# Altium schematic sheet [16] Camera Connector.SchDoc
size A3; DocumentNumber: 16; SheetNumber: 16; SheetTotal: 16
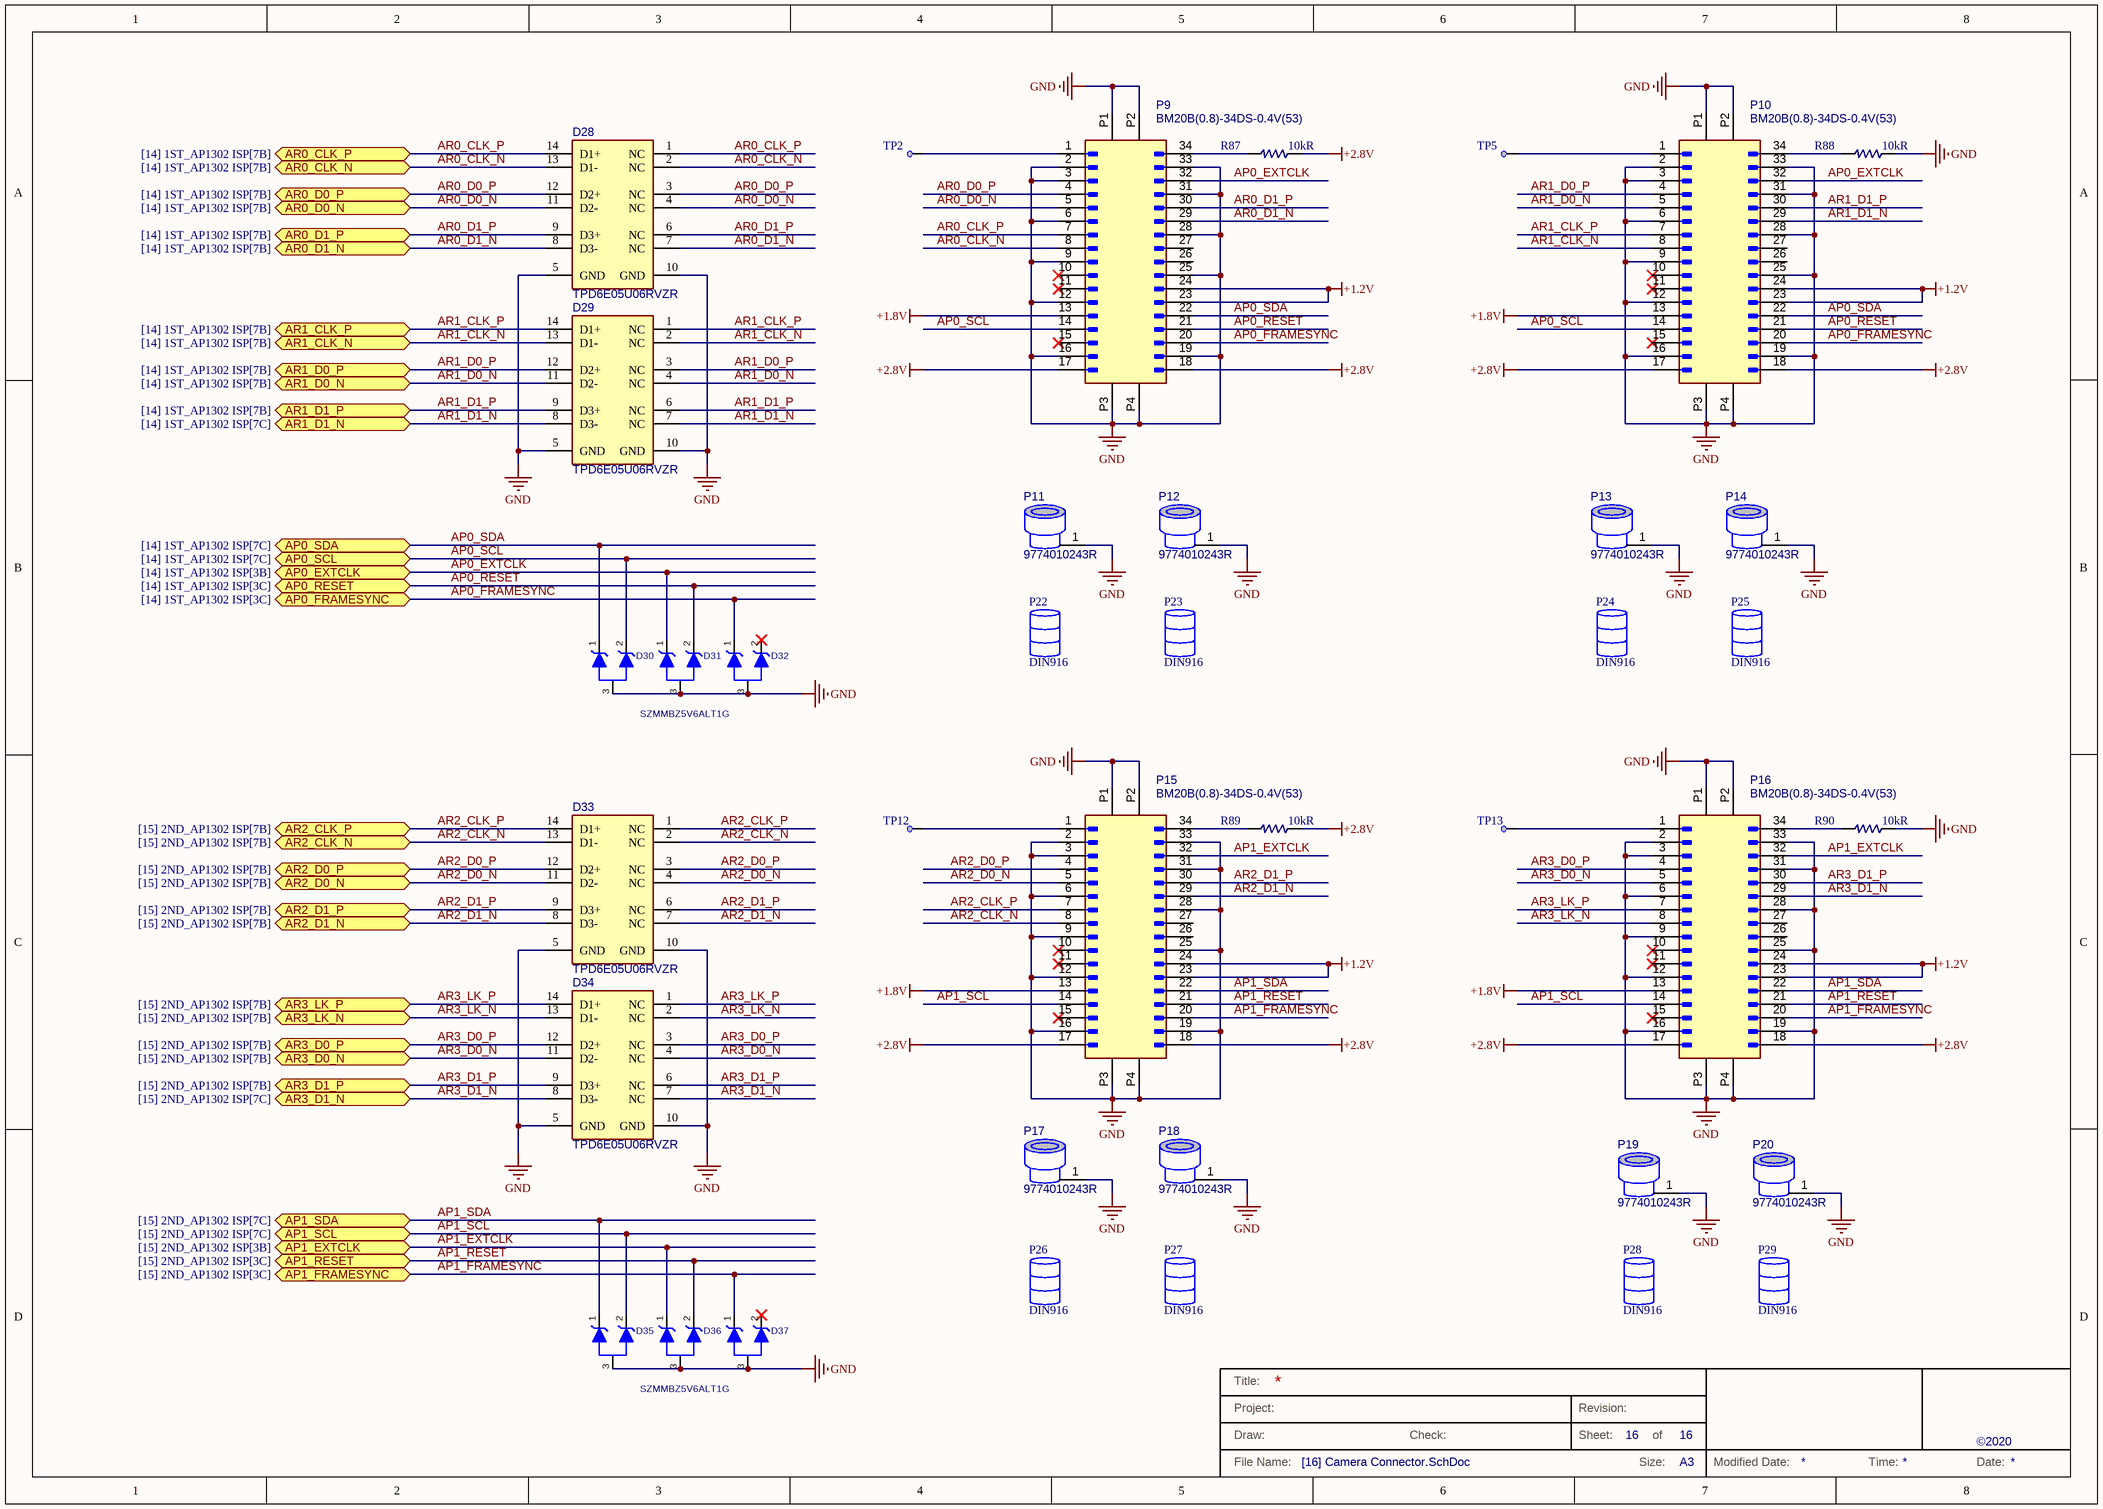
[diagram p0: [16] Camera Connector.SchDoc]

## Parts
D28  TPD6E05U06RVZR  [TPD6E05U06RVZR]
D29  TPD6E05U06RVZR  [TPD6E05U06RVZR]
D30  SZMMBZ5V6ALT1G  [ONSC-SOT-23-3-318-08_V]
D31  SZMMBZ5V6ALT1G  [ONSC-SOT-23-3-318-08_V]  (value not drawn)
D32  SZMMBZ5V6ALT1G  [ONSC-SOT-23-3-318-08_V]  (value not drawn)
D33  TPD6E05U06RVZR  [TPD6E05U06RVZR]
D34  TPD6E05U06RVZR  [TPD6E05U06RVZR]
D35  SZMMBZ5V6ALT1G  [ONSC-SOT-23-3-318-08_V]
D36  SZMMBZ5V6ALT1G  [ONSC-SOT-23-3-318-08_V]  (value not drawn)
D37  SZMMBZ5V6ALT1G  [ONSC-SOT-23-3-318-08_V]  (value not drawn)
P9  BM20B(0.8)-34DS-0.4V(53)  [BM20B(0.8)-34DS-0.4V(51)]
P10  BM20B(0.8)-34DS-0.4V(53)  [BM20B(0.8)-34DS-0.4V(51)]
P11  9774010243R  [WE_9774010243R]
P12  9774010243R  [WE_9774010243R]
P13  9774010243R  [WE_9774010243R]
P14  9774010243R  [WE_9774010243R]
P15  BM20B(0.8)-34DS-0.4V(53)  [BM20B(0.8)-34DS-0.4V(51)]
P16  BM20B(0.8)-34DS-0.4V(53)  [BM20B(0.8)-34DS-0.4V(51)]
P17  9774010243R  [WE_9774010243R]
P18  9774010243R  [WE_9774010243R]
P19  9774010243R  [WE_9774010243R]
P20  9774010243R  [WE_9774010243R]
P22  DIN916  [DIN916]
P23  DIN916  [DIN916]
P24  DIN916  [DIN916]
P25  DIN916  [DIN916]
P26  DIN916  [DIN916]
P27  DIN916  [DIN916]
P28  DIN916  [DIN916]
P29  DIN916  [DIN916]
R87  Resistance: 10kR  [R0402M]  (hidden comment: 10k)
R88  Resistance: 10kR  [R0402M]  (hidden comment: 10k)
R89  Resistance: 10kR  [R0402M]  (hidden comment: 10k)
R90  Resistance: 10kR  [R0402M]  (hidden comment: 10k)
TP2  TP  [Test point]  (value not drawn)  (net tie, no BOM)
TP5  TP  [Test point]  (value not drawn)  (net tie, no BOM)
TP12  TP  [Test point]  (value not drawn)  (net tie, no BOM)
TP13  TP  [Test point]  (value not drawn)  (net tie, no BOM)

## Ports
AP0_EXTCLK (bidir, see [14] 1ST_AP1302 ISP[3B]), AP0_FRAMESYNC (bidir, see [14] 1ST_AP1302 ISP[3C]), AP0_RESET (bidir, see [14] 1ST_AP1302 ISP[3C]), AP0_SCL (bidir, see [14] 1ST_AP1302 ISP[7C]), AP0_SDA (bidir, see [14] 1ST_AP1302 ISP[7C]), AP1_EXTCLK (bidir, see [15] 2ND_AP1302 ISP[3B]), AP1_FRAMESYNC (bidir, see [15] 2ND_AP1302 ISP[3C]), AP1_RESET (bidir, see [15] 2ND_AP1302 ISP[3C]), AP1_SCL (bidir, see [15] 2ND_AP1302 ISP[7C]), AP1_SDA (bidir, see [15] 2ND_AP1302 ISP[7C]), AR0_CLK_N (bidir, see [14] 1ST_AP1302 ISP[7B]), AR0_CLK_P (bidir, see [14] 1ST_AP1302 ISP[7B]), AR0_D0_N (bidir, see [14] 1ST_AP1302 ISP[7B]), AR0_D0_P (bidir, see [14] 1ST_AP1302 ISP[7B]), AR0_D1_N (bidir, see [14] 1ST_AP1302 ISP[7B]), AR0_D1_P (bidir, see [14] 1ST_AP1302 ISP[7B]), AR1_CLK_N (bidir, see [14] 1ST_AP1302 ISP[7B]), AR1_CLK_P (bidir, see [14] 1ST_AP1302 ISP[7B]), AR1_D0_N (bidir, see [14] 1ST_AP1302 ISP[7B]), AR1_D0_P (bidir, see [14] 1ST_AP1302 ISP[7B]), AR1_D1_N (bidir, see [14] 1ST_AP1302 ISP[7C]), AR1_D1_P (bidir, see [14] 1ST_AP1302 ISP[7B]), AR2_CLK_N (bidir, see [15] 2ND_AP1302 ISP[7B]), AR2_CLK_P (bidir, see [15] 2ND_AP1302 ISP[7B]), AR2_D0_N (bidir, see [15] 2ND_AP1302 ISP[7B]), AR2_D0_P (bidir, see [15] 2ND_AP1302 ISP[7B]), AR2_D1_N (bidir, see [15] 2ND_AP1302 ISP[7B]), AR2_D1_P (bidir, see [15] 2ND_AP1302 ISP[7B]), AR3_D0_N (bidir, see [15] 2ND_AP1302 ISP[7B]), AR3_D0_P (bidir, see [15] 2ND_AP1302 ISP[7B]), AR3_D1_N (bidir, see [15] 2ND_AP1302 ISP[7C]), AR3_D1_P (bidir, see [15] 2ND_AP1302 ISP[7B]), AR3_LK_N (bidir, see [15] 2ND_AP1302 ISP[7B]), AR3_LK_P (bidir, see [15] 2ND_AP1302 ISP[7B])

## Nets
+1.2V: P9.23 P9.24 P10.23 P10.24 P15.23 P15.24 P16.23 P16.24
+1.8V: P9.13 P10.13 P15.13 P16.13
+2.8V: P9.17 P9.18 P10.17 P10.18 P15.17 P15.18 P16.17 P16.18 R87.2 R89.2
GND: D28.5(GND) D28.10(GND) D29.5(GND) D29.10(GND) D30.3(A) D31.3(A) D32.3(A) D33.5(GND) D33.10(GND) D34.5(GND) D34.10(GND) D35.3(A) D36.3(A) D37.3(A) P9.2 P9.3 P9.6 P9.9 P9.12 P9.16 P9.19 P9.25 P9.28 P9.31 P9.33 P9.P1 P9.P2 P9.P3 P9.P4 P10.2 P10.3 P10.6 P10.9 P10.12 P10.16 P10.19 P10.25 P10.28 P10.31 P10.33 P10.P1 P10.P2 P10.P3 P10.P4 P11.1 P12.1 P13.1 P14.1 P15.2 P15.3 P15.6 P15.9 P15.12 P15.16 P15.19 P15.25 P15.28 P15.31 P15.33 P15.P1 P15.P2 P15.P3 P15.P4 P16.2 P16.3 P16.6 P16.9 P16.12 P16.16 P16.19 P16.25 P16.28 P16.31 P16.33 P16.P1 P16.P2 P16.P3 P16.P4 P17.1 P18.1 P19.1 P20.1 R88.2 R90.2
AP0_EXTCLK: D31.1(K1) P9.32 P10.32 ; port AP0_EXTCLK
AP0_FRAMESYNC: D32.1(K1) P9.20 P10.20 ; port AP0_FRAMESYNC
AP0_RESET: D31.2(K2) P9.21 P10.21 ; port AP0_RESET
AP0_SCL: D30.2(K2) P9.14 P10.14 ; port AP0_SCL
AP0_SDA: D30.1(K1) P9.22 P10.22 ; port AP0_SDA
AP1_EXTCLK: D36.1(K1) P15.32 P16.32 ; port AP1_EXTCLK
AP1_FRAMESYNC: D37.1(K1) P15.20 P16.20 ; port AP1_FRAMESYNC
AP1_RESET: D36.2(K2) P15.21 P16.21 ; port AP1_RESET
AP1_SCL: D35.2(K2) P15.14 P16.14 ; port AP1_SCL
AP1_SDA: D35.1(K1) P15.22 P16.22 ; port AP1_SDA
AR0_CLK_N: D28.2(NC) D28.13(D1-) P9.8 ; port AR0_CLK_N
AR0_CLK_P: D28.1(NC) D28.14(D1+) P9.7 ; port AR0_CLK_P
AR0_D0_N: D28.4(NC) D28.11(D2-) P9.5 ; port AR0_D0_N
AR0_D0_P: D28.3(NC) D28.12(D2+) P9.4 ; port AR0_D0_P
AR0_D1_N: D28.7(NC) D28.8(D3-) P9.29 ; port AR0_D1_N
AR0_D1_P: D28.6(NC) D28.9(D3+) P9.30 ; port AR0_D1_P
AR1_CLK_N: D29.2(NC) D29.13(D1-) P10.8 ; port AR1_CLK_N
AR1_CLK_P: D29.1(NC) D29.14(D1+) P10.7 ; port AR1_CLK_P
AR1_D0_N: D29.4(NC) D29.11(D2-) P10.5 ; port AR1_D0_N
AR1_D0_P: D29.3(NC) D29.12(D2+) P10.4 ; port AR1_D0_P
AR1_D1_N: D29.7(NC) D29.8(D3-) P10.29 ; port AR1_D1_N
AR1_D1_P: D29.6(NC) D29.9(D3+) P10.30 ; port AR1_D1_P
AR2_CLK_N: D33.2(NC) D33.13(D1-) P15.8 ; port AR2_CLK_N
AR2_CLK_P: D33.1(NC) D33.14(D1+) P15.7 ; port AR2_CLK_P
AR2_D0_N: D33.4(NC) D33.11(D2-) P15.5 ; port AR2_D0_N
AR2_D0_P: D33.3(NC) D33.12(D2+) P15.4 ; port AR2_D0_P
AR2_D1_N: D33.7(NC) D33.8(D3-) P15.29 ; port AR2_D1_N
AR2_D1_P: D33.6(NC) D33.9(D3+) P15.30 ; port AR2_D1_P
AR3_D0_N: D34.4(NC) D34.11(D2-) P16.5 ; port AR3_D0_N
AR3_D0_P: D34.3(NC) D34.12(D2+) P16.4 ; port AR3_D0_P
AR3_D1_N: D34.7(NC) D34.8(D3-) P16.29 ; port AR3_D1_N
AR3_D1_P: D34.6(NC) D34.9(D3+) P16.30 ; port AR3_D1_P
AR3_LK_N: D34.2(NC) D34.13(D1-) P16.8 ; port AR3_LK_N
AR3_LK_P: D34.1(NC) D34.14(D1+) P16.7 ; port AR3_LK_P
NetP9_1: P9.1 TP2.1(TP)
NetP9_34: P9.34 R87.1
NetP10_1: P10.1 TP5.1(TP)
NetP10_34: P10.34 R88.1
NetP15_1: P15.1 TP12.1(TP)
NetP15_34: P15.34 R89.1
NetP16_1: P16.1 TP13.1(TP)
NetP16_34: P16.34 R90.1

Not connected (* = marked no-connect by the designer): D32 2(K2)*; D37 2(K2)*; P9 10* 11* 15* 26 27; P10 10* 11* 15* 26 27; P15 10* 11* 15* 26 27; P16 10* 11* 15* 26 27

## Notes on the sheet
- Title:
- Project:
- Draw:
- Check:
- Revision:
- Sheet:
- of
- ©2020
- File Name:
- Size:
- A3
- Modified Date:
- Time:
- Date:

## Library data of the parts
D28 D29 D33 D34 = TPD6E05U06RVZR_symbol: ESD Suppressor Diode Array ±15kV@Air Gap/±12kV@Contact Disc 14-Pin UQFN T/R; Manufacturer 1: Texas Instruments; Direction: Unidirectional; Number of Bidirectional Channels: 6; Reverse Standoff Voltage: 5.5V; Min Breakdown Voltage: 6V; Clamping Voltage: 14V; Peak Pulse Power: 40W; Power Line Protection: Yes; Polarity: Bidirectional; Leakage Current: 10nA; Peak Pulse Current: 2.5A; Interface: LVDS,USB,Ethernet,HDMI,PCIe,SATA; Supplier 1: Digi-Key; Manufacturer Part Number 1: TPD6E05U06RVZR; Stock 1: 0; Pricing 1: 1=0.93000, 10=0.81900, 100=0.62750, 500=0.49608, 1000=0.40950 (USD); RoHS: Yes; Mount: Surface Mount; Number of Pins: 14; Min Operating Temperature: -40°C; Max Operating Temperature: 125°C; Packaging: Tape and Reel; Package Quantity: 3000; Number of Channels: 6; Breakdown Voltage: 6V; Termination: SMD/SMT; Max Power Dissipation: 40W; Working Voltage: 5.5V; Length: 3.6mm; Depth: 1.45mm; Radiation Hardening: No; Lead Free: Lead Free; RoHS Compliant: Yes; ComponentLink1URL: https://datasheet.ciiva.com/29883/tpd6e05u06-29883847.pdf?src-supplier=Avnet; ComponentLink1Description: https://datasheet.ciiva.com/29883/tpd6e05u06-29883847.pdf?src-supplier=Avnet; ComponentLink2URL: https://datasheet.ciiva.com/26918/getdatasheetpartid-747210-26918045.pdf?src-supplier=Verical; ComponentLink2Description: https://datasheet.ciiva.com/26918/getdatasheetpartid-747210-26918045.pdf?src-supplier=Verical; Supplier Part Number 1: 296-39349-6-ND
D30-D32 D35-D37 = CMP-00699-1: TVS DIODE 3V 8V SOT23-3; Manufacturer 1: ON Semiconductor; Peak Pulse Power: 24W; Test Current: 20mA; Breakdown Voltage: 5.32V; ESD Protection: Yes; Number of Unidirectional Channels: 2; Element Configuration: Common Anode; Polarity: Unidirectional; Max Breakdown Voltage: 5.88V; Leakage Current: 5uA; Direction: Unidirectional,Bidirectional; Power Line Protection: No; Max Surge Current: 3A; Composition: Zener; Max Power Dissipation: 24W; Case/Package: SOT-23-3; Number of Pins: 3; Termination: SMD/SMT; Packaging: Tape and Reel; Min Operating Temperature: -55°C; Depth: 1.3mm; Number of Channels: 2; Reverse Standoff Voltage: 3V; Working Voltage: 3V; Manufacturer Part Number 1: SZMMBZ5V6ALT1G; Clamping Voltage: 8V; Max Reverse Leakage Current: 5uA; Lead Free: Lead Free; Power Dissipation: 24W; Height: 1.01mm; Width: 1.4mm; Min Breakdown Voltage: 5.32V; Package Quantity: 1; Radiation Hardening: No; Max Operating Temperature: 150°C; Operating Supply Voltage: 3V; Peak Pulse Current: 3A; Length: 2.9mm
P9 P10 P15 P16 = BM20B(0.8)-34DP-0.4V(51): Board to Board & Mezzanine Connectors 34P DR RCP B2B/B2FPC 0.8mm H 0.4mm P VSMT; Manufacturer: Hirose; Package: None; Value: BM20B(0.8)-34DS-0.4V(53); Availability: Unavailable; Price: None; MP: BM20B(0.8)-34DS-0.4V(53); Supplier 1: Mouser; Manufacturer Part Number: BM20B(0.8)-34DS-0.4V(53); RoHS: Yes; Category: Headers and Wire Housings; Stock 1: 1896; Pricing 1: 1=1.46000, 10=1.22000, 50=1.22000, 100=1.14000, 250=1.03000, 500=0.94500, 1000=0.80900, 2000=0.75500, 5000=0.71800, 10000=0.70100 (USD); ComponentLink1URL: https://datasheet.ciiva.com/29164/en-bm20-20130409-29164303.pdf?src-supplier=Digi-Key; ComponentLink1Description: https://datasheet.ciiva.com/29164/en-bm20-20130409-29164303.pdf?src-supplier=Digi-Key; Supplier Part Number 1: 798-BM20B0834DS04V53
P11-P14 P17-P20 = 9774010243R: Spacer Material: Steel, Tin-Plated Mounting: SMT Series: WA-SMST Thread D: M2; Manufacturer 1: Wurth Electronics; Plating: Tin; Threaded/Unthreaded: Threaded; Outside Diameter: 0.171inch; Manufacturer Part Number 1: 9774010243R; Supplier 1: Digi-Key; Supplier Part Number 1: 732-7065-1-ND; RoHS: Yes; Category: Spacers, Standoffs; Stock 1: 29568; Pricing 1: 1=1.13000, 10=1.06600, 50=0.95000, 100=0.86900, 500=0.81100 (USD); Material: Steel; Length: 0.095inch; REACH SVHC: Unknown; ComponentLink1URL: http://www.farnell.com/datasheets/1960359.pdf?src-supplier=Farnell; ComponentLink1Description: http://www.farnell.com/datasheets/1960359.pdf?src-supplier=Farnell; ComponentLink2URL: https://media.digikey.com/pdf/Data%20Sheets/Wurth%20Electronics%20PDFs/WA-SMSx_Performance_Flyer.pdf?src-supplier=Digi-Key; ComponentLink2Description: https://media.digikey.com/pdf/Data%20Sheets/Wurth%20Electronics%20PDFs/WA-SMSx_Performance_Flyer.pdf?src-supplier=Digi-Key; ComponentLink3URL: http://www.mouser.com/ds/2/445/9774010243R-611450.pdf?src-supplier=Mouser; ComponentLink3Description: http://www.mouser.com/ds/2/445/9774010243R-611450.pdf?src-supplier=Mouser; ComponentLink4URL: http://www.farnell.com/datasheets/1960359.pdf?src-supplier=Element14; ComponentLink4Description: http://www.farnell.com/datasheets/1960359.pdf?src-supplier=Element14; ComponentLink5URL: http://www.farnell.com/datasheets/1960359.pdf?src-supplier=Newark; ComponentLink5Description: http://www.farnell.com/datasheets/1960359.pdf?src-supplier=Newark
P22-P29 = DIN916: Hexagon socket set screws with cup point; Manufacturer Part Number 1: DIN916; Manufacturer 1: N/A
R87-R90 = RES_SMD: RES SMD 10K OHM 1% 1/16W 0402; Manufacturer: Yageo; Manufacturer Part Number: RC0402FR-0710KL; Temperature Coefficient: 100ppm/°C; Voltage Rating (DC): 50V; Power Rating: 62.5mW; Supplier 1: Digi-Key; Supplier Part Number 1: 311-10.0KLRTR-ND; Stock 1: 58760000; Pricing 1: 10000 = 0.001630, 30000 = 0.001440, 50000 = 0.001320, 100000 = 0.001290 (USD); RoHS: Yes; Case/Package: 0402; Number of Pins: 2; Case Code (Imperial): 0402; Case Code (Metric): 1005; Min Operating Temperature: -55°C; Max Operating Temperature: 155°C; Composition: Thick Film; Tolerance: 1%; Packaging: Tape and Reel; Voltage Rating: 50V; Termination: SMD/SMT; Military Standard: Not; Working Voltage: 50V; Number of Terminations: 2; Length: 1mm; Height: 0.32mm; Width: 0.5mm; Depth: 0.5mm; Lead Pitch: 0.2mm; REACH SVHC: No SVHC; Lead Free: Lead Free; ComponentLink1URL: https://datasheet.ciiva.com/7660/38568-7660787.pdf?src-supplier=Element14; ComponentLink1Description: https://datasheet.ciiva.com/7660/38568-7660787.pdf?src-supplier=Element14; ComponentLink2URL: https://datasheet.ciiva.com/7849/1784430-7849813.pdf?src-supplier=Element14; ComponentLink2Description: https://datasheet.ciiva.com/7849/1784430-7849813.pdf?src-supplier=Element14; ComponentLink3URL: https://datasheet.ciiva.com/7849/1686128-7849814.pdf?src-supplier=Element14; ComponentLink3Description: https://datasheet.ciiva.com/7849/1686128-7849814.pdf?src-supplier=Element14; ComponentLink4URL: https://datasheet.ciiva.com/7849/1784430-7849815.pdf?src-supplier=Element14; ComponentLink4Description: https://datasheet.ciiva.com/7849/1784430-7849815.pdf?src-supplier=Element14; ComponentLink5URL: https://datasheet.ciiva.com/22747/1018594-22747512.pdf?src-supplier=Element14; ComponentLink5Description: https://datasheet.ciiva.com/22747/1018594-22747512.pdf?src-supplier=Element14; ComponentLink6URL: https://datasheet.ciiva.com/12667/pyu-rc0402-51-rohs-l-6-r-12667067.pdf?src-supplier=Mouser; ComponentLink6Description: https://datasheet.ciiva.com/12667/pyu-rc0402-51-rohs-l-6-r-12667067.pdf?src-supplier=Mouser; ComponentLink7URL: https://datasheet.ciiva.com/7983/1018594-7983486.pdf?src-supplier=Element14; ComponentLink7Description: https://datasheet.ciiva.com/7983/1018594-7983486.pdf?src-supplier=Element14
TP2 TP5 TP12 TP13 = TestPoint